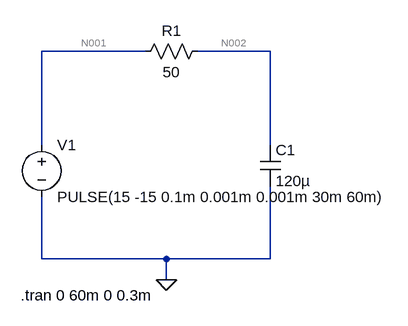
[diagram p0: schematic schemeRC.asc]
schemeRC.asc, the LTspice schematic file:
Version 4
SHEET 1 880 680
WIRE 192 144 32 144
WIRE 384 144 272 144
WIRE 32 288 32 144
WIRE 384 288 384 144
WIRE 32 464 32 368
WIRE 224 464 32 464
WIRE 384 464 384 352
WIRE 384 464 224 464
WIRE 224 496 224 464
FLAG 224 496 0
SYMBOL res 288 128 R90
WINDOW 0 0 56 VBottom 2
WINDOW 3 32 56 VTop 2
SYMATTR InstName R1
SYMATTR Value 50
SYMBOL voltage 32 272 R0
WINDOW 123 0 0 Left 0
WINDOW 39 0 0 Left 0
SYMATTR InstName V1
SYMATTR Value PULSE(15 -15 0.1m 0.001m 0.001m 30m 60m)
SYMBOL cap 368 288 R0
SYMATTR InstName C1
SYMATTR Value 120µ
TEXT 0 520 Left 2 !.tran 0 60m 0 0.3m

The netlist it stands for:
* schemeRC.asc
R1 N002 N001 50
V1 N001 0 PULSE(15 -15 0.1m 0.001m 0.001m 30m 60m)
C1 N002 0 120µ
.tran 0 60m 0 0.3m
.backanno
.end

* Results of the author's LTspice run, read from the files saved beside the schematic
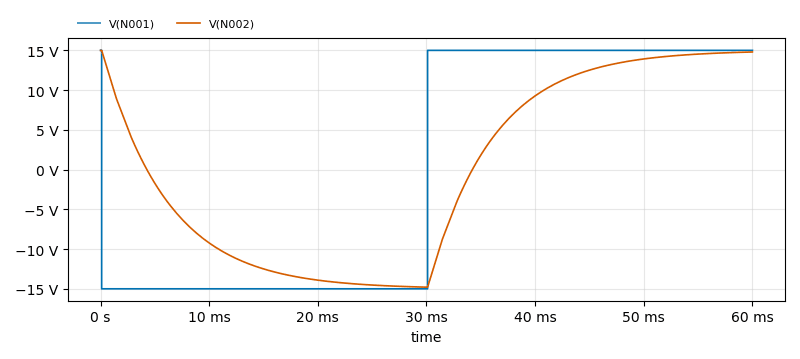
[diagram p1: Transient Analysis of schemeRC.asc, plotted from the saved traces]
* Transient Analysis, 1 run:
*   V(N001): min -15 V, max 15 V, average -500 µV, rms 15 V, last 15 V
*   V(N002): min -14.8 V, max 15 V, average 20 mV, rms 11.7 V, last 14.8 V